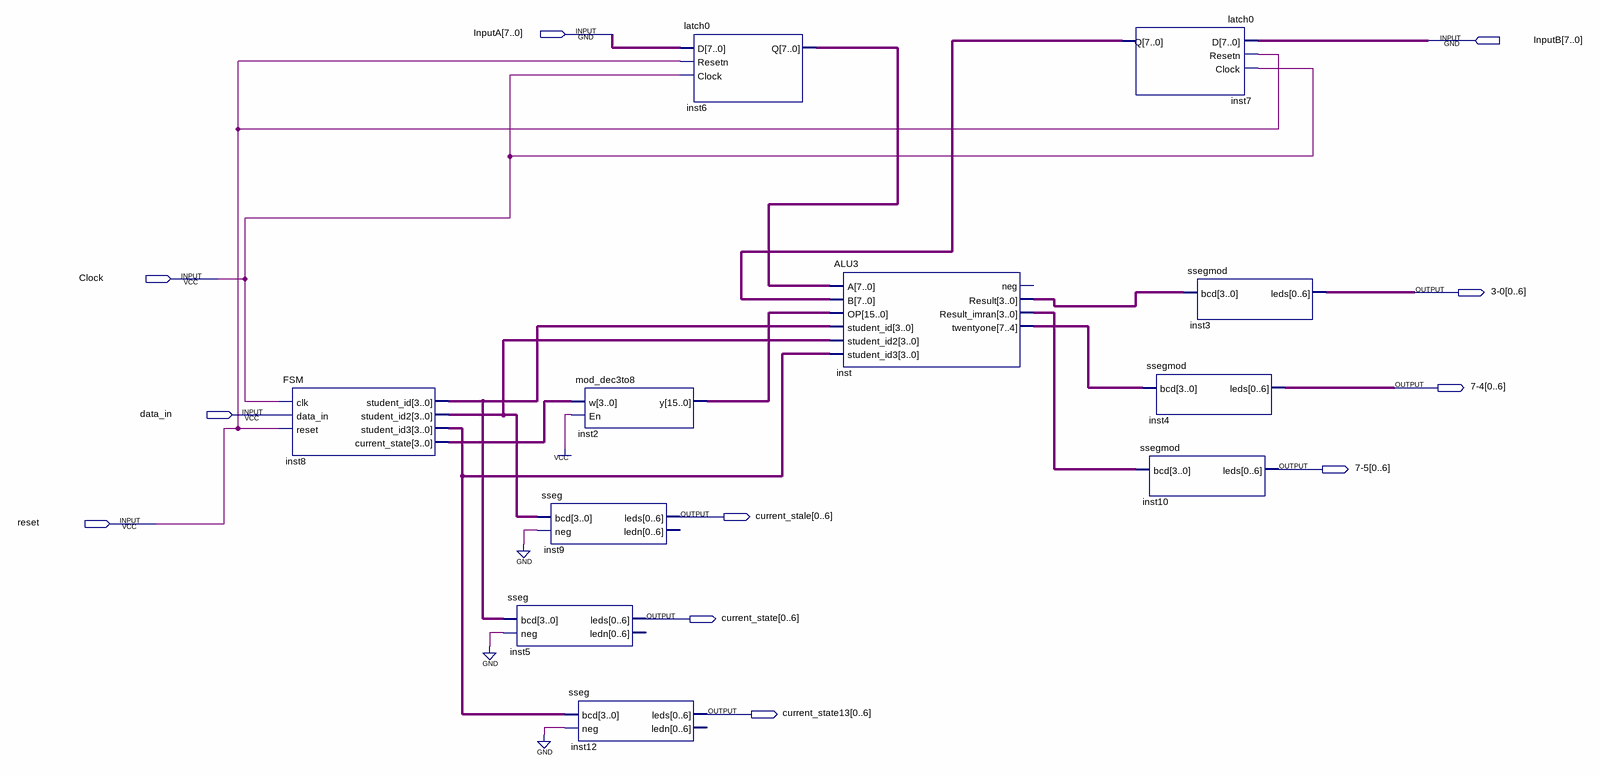
[diagram p0: schematic sheet]
// Quartus schematic prob3.bdf as structural Verilog: 11 symbols, 11 pins
module prob3 (
  input  [7:0] InputA,
  input  [7:0] InputB,
  input  Clock,
  input  data_in,
  input  reset,
  output [0:6] \3-0 ,
  output [0:6] \7-4 ,
  output [0:6] \7-5 ,
  output [0:6] current_stale,
  output [0:6] current_state,
  output [0:6] current_state13
);

  wire [3:0] inst8_current_state, inst8_student_id, inst8_student_id2, inst8_student_id3, inst_result,
       inst_result_imran, inst_twentyone;
  wire [7:0] inst6_q, inst7_q;
  wire [15:0] inst2_y;

  FSM inst8 (
    .clk(Clock), .data_in(data_in), .reset(reset), .student_id(inst8_student_id),
    .student_id2(inst8_student_id2), .student_id3(inst8_student_id3), .current_state(inst8_current_state));
  sseg inst9 (.bcd(inst8_student_id2), .neg(1'b0), .leds(current_stale));  // open: ledn
  sseg inst5 (.bcd(inst8_student_id), .neg(1'b0), .leds(current_state));  // open: ledn
  mod_dec3to8 inst2 (.w(inst8_current_state), .En(1'b1), .y(inst2_y));
  sseg inst12 (.bcd(inst8_student_id3), .neg(1'b0), .leds(current_state13));  // open: ledn
  latch0 inst6 (.D(InputA), .Resetn(reset), .Clock(Clock), .Q(inst6_q));
  ALU3 inst (
    .A(inst6_q), .B(inst7_q), .OP(inst2_y), .student_id(inst8_student_id), .student_id2(inst8_student_id2),
    .student_id3(inst8_student_id3), .Result(inst_result), .Result_imran(inst_result_imran),
    .twentyone(inst_twentyone));  // open: neg
  latch0 inst7 (.D(InputB), .Resetn(reset), .Clock(Clock), .Q(inst7_q));
  ssegmod inst4 (.bcd(inst_twentyone), .leds(\7-4 ));
  ssegmod inst10 (.bcd(inst_result_imran), .leds(\7-5 ));
  ssegmod inst3 (.bcd(inst_result), .leds(\3-0 ));
endmodule
